# Altium schematic sheet ideal-diode.SchDoc
size A
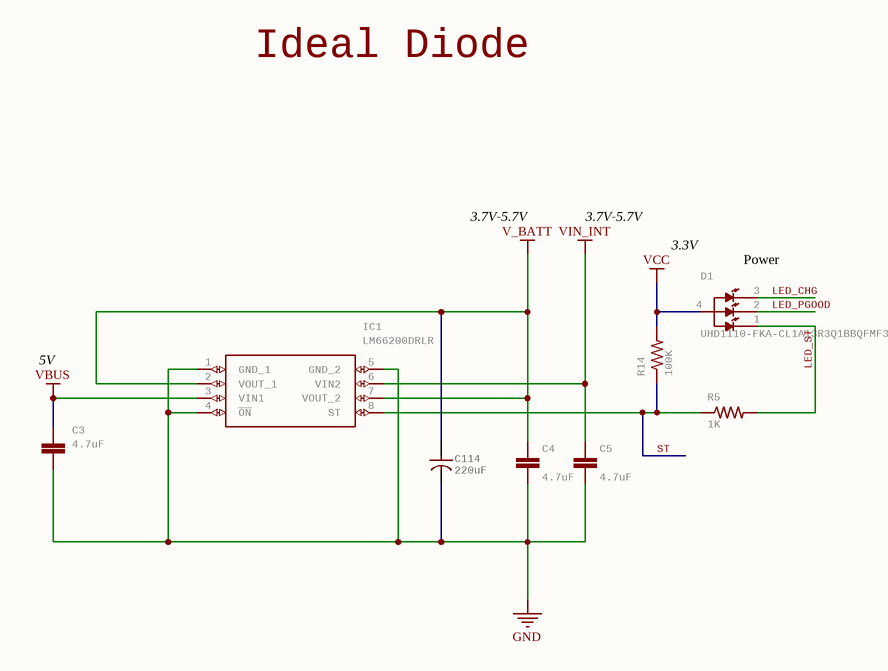
[diagram p0: ideal-diode.SchDoc]

## Parts
C3  4.7uF  [0402-CAP]
C4  4.7uF  [0402-CAP]
C5  4.7uF  [0402-CAP]
C114  220uF  [CAP-TANT-1411]
D1  UHD1110-FKA-CL1A13R3Q1BBQFMF3  [LED_UHD1110-FKA-CL1A13R3Q1BBQFMF3]
IC1  LM66200DRLR  [SOTFL50P160X60-8N]
R5  1K  [0402-RES]
R14  100K  [0402-RES]

## Nets
GND: C3.1 C4.1 C5.1 C114.2 IC1.1(GND_1) IC1.4(~{ON}) IC1.5(GND_2)
V_BATT: C4.2 C114.1 IC1.2(VOUT_1) IC1.7(VOUT_2)
VBUS: C3.2 IC1.3(VIN1)
VCC: D1.4(ANODE) R14.2
VIN_INT: C5.2 IC1.6(VIN2)
LED_CHG: D1.3(RED)
LED_PGOOD: D1.2(GREEN)
LED_ST: D1.1(BLUE) R5.2
ST: IC1.8(ST) R5.1 R14.1

## Notes on the sheet
- Ideal Diode
- 3.7V-5.7V
- (near D1) 3.3V
- (near D1) Power
- 5V

## Library data of the parts
C3-C5 = CAP0402-CAP: CapacitorStandard 0603 ceramic capacitor, and 0.1" leaded capacitor.; MPN: JMK105BBJ475MV-F; GateName_1: G$1; SymbolName_1: CAP; DeviceName: 0402-CAP; LibraryName: sfe; DeviceSetName: CAP; Part Number: JMK105BBJ475MV-F
C114 = CAP_POL: MANUFACTURER P/N: F930J227MBA; Part Number: F930J227MBA; DISTRIBUTOR: *; DISTRIBUTOR P/N: *; Value: 220uF; Parameter 1: *; MPN: F930J227MBA
D1 = UHD1110-FKA-CL1A13R3Q1BBQFMF3: LED RGB SMD, SIZE 1 X 1 mm Check availability; GateName_1: G$1; MF: Cree Inc.; SymbolName_1: UHD1110-FKA-CL1A13R3Q1BBQFMF3; LibraryName: UHD1110-FKA-CL1A13R3Q1BBQFMF3; DeviceSetName: UHD1110-FKA-CL1A13R3Q1BBQFMF3; AVAILABILITY: In Stock; MP: UHD1110-FKA-CL1A13R3Q1BBQFMF3; MPN: UHD1110-FKA-CL1A13r3q1BBQFMF3; PACKAGE: 0404 Cree Inc.; PRICE: None; PURCHASE-URL: https://pricing.snapeda.com/search/part/UHD1110-FKA-CL1A13R3Q1BBQFMF3/?ref=eda; Part Number: UHD1110-FKA-CL1A13r3q1BBQFMF3
IC1 = LM66200DRLR: 1.6-V to 5.5-V, 40-m, 2.5-A, low-IQ, dual ideal diode   Source:  Datasheet; MANUFACTURER_NAME: Texas Instruments; GateName_1: G$1; SymbolName_1: LM66200DRLR; LibraryName: LM66200DRLR; DeviceSetName: LM66200DRLR; HEIGHT: 0.6mm; MANUFACTURER_PART_NUMBER: LM66200DRLR; MOUSER_PART_NUMBER: 595-LM66200DRLR; MOUSER_PRICE-STOCK: https://www.mouser.co.uk/ProductDetail/Texas-Instruments/LM66200DRLR?qs=Rp5uXu7WBW90hnpZAkIOdQ%3D%3D; MPN: LM66200DRLR; Part Number: LM66200DRLR
R5 = RESISTOR0402-RES: ResistorBasic schematic elements and footprints for 0603, 1206, and PTH resistors.; MPN: CRCW04021K00FKEDC; GateName_1: G$1; SymbolName_1: RESISTOR; DeviceName: 0402-RES; LibraryName: sfe; DeviceSetName: RESISTOR; Part Number: CRCW04021K00FKEDC
R14 = RESISTOR0402-RES: ResistorBasic schematic elements and footprints for 0603, 1206, and PTH resistors.; MPN: AC0402FR-07100KL; GateName_1: G$1; SymbolName_1: RESISTOR; DeviceName: 0402-RES; LibraryName: sfe; DeviceSetName: RESISTOR; Part Number: AC0402FR-07100KL